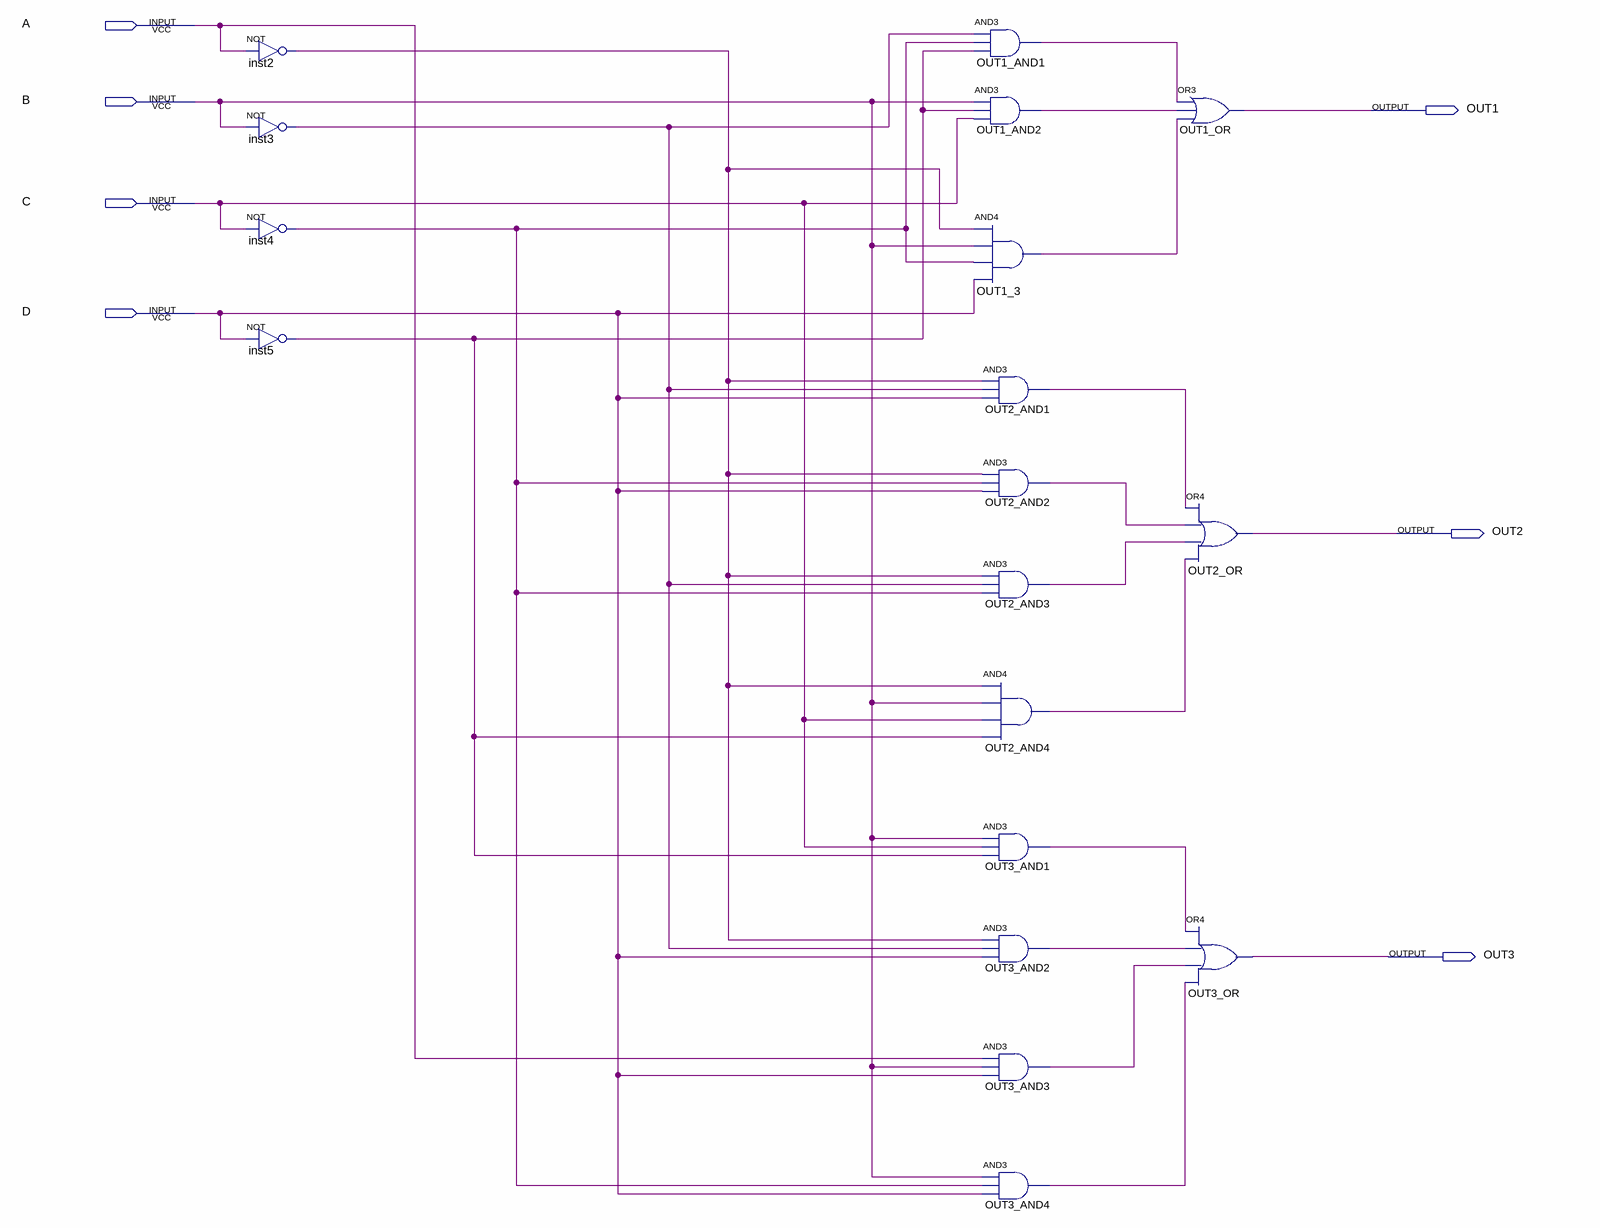
[diagram p0: schematic sheet]
// Quartus schematic Lab1_Lee.bdf as structural Verilog: 18 symbols, 7 pins
module Lab1_Lee (
  input  A,
  input  B,
  input  C,
  input  D,
  output OUT1,
  output OUT2,
  output OUT3
);

  wire inst2_out, inst3_out, inst4_out, inst5_out, OUT1_3_out, OUT1_AND1_out, OUT1_AND2_out, OUT2_AND1_out,
       OUT2_AND2_out, OUT2_AND3_out, OUT2_AND4_out, OUT3_AND1_out, OUT3_AND2_out, OUT3_AND3_out,
       OUT3_AND4_out;

  not inst2 (inst2_out, A);
  not inst3 (inst3_out, B);
  not inst4 (inst4_out, C);
  not inst5 (inst5_out, D);
  and OUT1_AND1 (OUT1_AND1_out, inst3_out, inst4_out, inst5_out);
  and OUT1_AND2 (OUT1_AND2_out, B, inst5_out, C);
  and OUT1_3 (OUT1_3_out, inst2_out, B, inst4_out, D);
  and OUT2_AND1 (OUT2_AND1_out, inst2_out, inst3_out, D);
  and OUT2_AND2 (OUT2_AND2_out, inst2_out, inst4_out, D);
  and OUT2_AND3 (OUT2_AND3_out, inst2_out, inst3_out, inst4_out);
  and OUT2_AND4 (OUT2_AND4_out, inst2_out, B, C, inst5_out);
  and OUT3_AND1 (OUT3_AND1_out, B, C, inst5_out);
  and OUT3_AND2 (OUT3_AND2_out, inst2_out, inst3_out, D);
  and OUT3_AND3 (OUT3_AND3_out, A, B, D);
  and OUT3_AND4 (OUT3_AND4_out, B, inst4_out, D);
  or OUT1_OR (OUT1, OUT1_AND1_out, OUT1_AND2_out, OUT1_3_out);
  or OUT2_OR (OUT2, OUT2_AND1_out, OUT2_AND2_out, OUT2_AND3_out, OUT2_AND4_out);
  or OUT3_OR (OUT3, OUT3_AND1_out, OUT3_AND2_out, OUT3_AND3_out, OUT3_AND4_out);
endmodule
